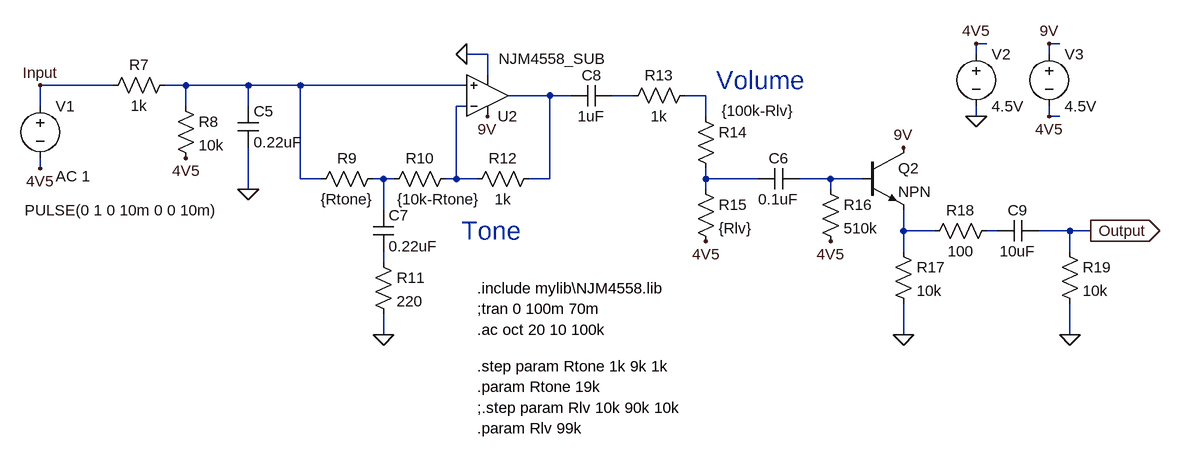
[diagram p0: schematic Tube_Screamer_Tone_10k.asc]
Tube_Screamer_Tone_10k.asc, the LTspice schematic file:
Version 4
SHEET 1 2708 1040
WIRE 1648 432 1632 432
WIRE 1760 432 1744 432
WIRE 880 448 848 448
WIRE 1632 448 1632 432
WIRE 1744 448 1744 432
WIRE 880 480 880 448
WIRE 304 496 192 496
WIRE 416 496 384 496
WIRE 512 496 416 496
WIRE 592 496 512 496
WIRE 848 496 592 496
WIRE 976 512 912 512
WIRE 1008 512 976 512
WIRE 1104 512 1072 512
WIRE 1216 512 1184 512
WIRE 192 528 192 496
WIRE 416 528 416 496
WIRE 512 528 512 496
WIRE 848 528 832 528
WIRE 1216 544 1216 512
WIRE 1632 544 1632 528
WIRE 1744 544 1744 528
WIRE 1760 544 1744 544
WIRE 192 624 192 608
WIRE 592 640 592 496
WIRE 624 640 592 640
WIRE 720 640 704 640
WIRE 736 640 720 640
WIRE 832 640 832 528
WIRE 832 640 816 640
WIRE 864 640 832 640
WIRE 976 640 976 512
WIRE 976 640 944 640
WIRE 1216 640 1216 624
WIRE 1296 640 1216 640
WIRE 1408 640 1360 640
WIRE 1456 640 1408 640
WIRE 512 656 512 592
WIRE 1216 656 1216 640
WIRE 1408 656 1408 640
WIRE 720 688 720 640
WIRE 1520 720 1520 688
WIRE 1568 720 1520 720
WIRE 1664 720 1648 720
WIRE 1776 720 1728 720
WIRE 1808 720 1776 720
WIRE 1520 752 1520 720
WIRE 1776 752 1776 720
WIRE 720 768 720 752
WIRE 720 880 720 848
WIRE 1520 880 1520 832
WIRE 1776 880 1776 832
FLAG 416 608 4V5
FLAG 512 656 0
FLAG 720 880 0
FLAG 1216 736 4V5
FLAG 1520 880 0
FLAG 1520 592 9V
FLAG 1408 736 4V5
FLAG 1776 880 0
FLAG 1808 720 Output
IOPIN 1808 720 Out
FLAG 192 496 Input
FLAG 880 544 9V
FLAG 848 448 0
FLAG 1632 544 0
FLAG 1632 432 4V5
FLAG 1744 544 4V5
FLAG 1744 432 9V
FLAG 192 624 4V5
SYMBOL voltage 192 512 R0
WINDOW 123 24 124 Left 2
WINDOW 39 0 0 Left 2
WINDOW 3 -24 176 Left 2
SYMATTR Value2 AC 1
SYMATTR InstName V1
SYMATTR Value PULSE(0 1 0 10m 0 0 10m)
SYMBOL res 400 480 R90
WINDOW 0 0 56 VBottom 2
WINDOW 3 32 56 VTop 2
SYMATTR InstName R7
SYMATTR Value 1k
SYMBOL res 400 512 R0
SYMATTR InstName R8
SYMATTR Value 10k
SYMBOL cap 496 528 R0
SYMATTR InstName C5
SYMATTR Value 0.22uF
SYMBOL Opamps\\opamp2 880 576 M180
WINDOW 3 17 121 Left 2
SYMATTR Value NJM4558_SUB
SYMATTR InstName U2
SYMBOL res 720 624 R90
WINDOW 0 0 56 VBottom 2
WINDOW 3 32 56 VTop 2
SYMATTR InstName R9
SYMATTR Value {Rtone}
SYMBOL res 832 624 R90
WINDOW 0 0 56 VBottom 2
WINDOW 3 32 27 VTop 2
SYMATTR InstName R10
SYMATTR Value {10k-Rtone}
SYMBOL cap 704 688 R0
SYMATTR InstName C7
SYMATTR Value 0.22uF
SYMBOL res 704 752 R0
SYMATTR InstName R11
SYMATTR Value 220
SYMBOL res 960 624 R90
WINDOW 0 0 56 VBottom 2
WINDOW 3 32 56 VTop 2
SYMATTR InstName R12
SYMATTR Value 1k
SYMBOL cap 1072 496 R90
WINDOW 0 0 32 VBottom 2
WINDOW 3 32 32 VTop 2
SYMATTR InstName C8
SYMATTR Value 1uF
SYMBOL res 1200 496 R90
WINDOW 0 0 56 VBottom 2
WINDOW 3 32 56 VTop 2
SYMATTR InstName R13
SYMATTR Value 1k
SYMBOL res 1200 528 R0
WINDOW 3 40 7 Left 2
SYMATTR InstName R14
SYMATTR Value {100k-Rlv}
SYMBOL res 1200 640 R0
SYMATTR InstName R15
SYMATTR Value {Rlv}
SYMBOL cap 1360 624 R90
WINDOW 0 0 32 VBottom 2
WINDOW 3 32 32 VTop 2
SYMATTR InstName C6
SYMATTR Value 0.1uF
SYMBOL res 1392 640 R0
SYMATTR InstName R16
SYMATTR Value 510k
SYMBOL npn 1456 592 R0
SYMATTR InstName Q2
SYMBOL res 1504 736 R0
SYMATTR InstName R17
SYMATTR Value 10k
SYMBOL res 1664 704 R90
WINDOW 0 0 56 VBottom 2
WINDOW 3 32 56 VTop 2
SYMATTR InstName R18
SYMATTR Value 100
SYMBOL cap 1728 704 R90
WINDOW 0 0 32 VBottom 2
WINDOW 3 32 32 VTop 2
SYMATTR InstName C9
SYMATTR Value 10uF
SYMBOL res 1760 736 R0
SYMATTR InstName R19
SYMATTR Value 10k
SYMBOL voltage 1632 432 R0
SYMATTR InstName V2
SYMATTR Value 4.5V
SYMBOL voltage 1744 432 R0
SYMATTR InstName V3
SYMATTR Value 4.5V
TEXT 840 720 Left 4 ;Tone
TEXT 1232 488 Left 4 ;Volume
TEXT 864 808 Left 2 !.include mylib\\NJM4558.lib
TEXT 864 840 Left 2 !;tran 0 100m 70m
TEXT 864 872 Left 2 !.ac oct 20 10 100k
TEXT 864 928 Left 2 !.step param Rtone 1k 9k 1k
TEXT 864 992 Left 2 !;.step param Rlv 10k 90k 10k
TEXT 864 960 Left 2 !.param Rtone 19k
TEXT 864 1024 Left 2 !.param Rlv 99k

The netlist it stands for:
* Tube_Screamer_Tone_10k.asc
V1 Input 4V5 PULSE(0 1 0 10m 0 0 10m) AC 1
R7 N001 Input 1k
R8 N001 4V5 10k
C5 N001 0 0.22uF
XU2 N001 N005 9V 0 N002 NJM4558_SUB  ; pins In+ In- V+ V- OUT
R9 N006 N001 {Rtone}
R10 N005 N006 {10k-Rtone}
C7 N006 N011 0.22uF
R11 N011 0 220
R12 N002 N005 1k
C8 N003 N002 1uF
R13 N004 N003 1k
R14 N004 N007 {100k-Rlv}
R15 N007 4V5 {Rlv}
C6 N008 N007 0.1uF
R16 N008 4V5 510k
Q2 9V N008 N009 0 NPN
R17 N009 0 10k
R18 N010 N009 100
C9 Output N010 10uF
R19 Output 0 10k
V2 4V5 0 4.5V
V3 9V 4V5 4.5V
.model NPN NPN
.model PNP PNP
.lib standard.bjt
* Tone
* Volume
.include mylib\NJM4558.lib
;tran 0 100m 70m
.ac oct 20 10 100k
.step param Rtone 1k 9k 1k
;.step param Rlv 10k 90k 10k
.param Rtone 19k
.param Rlv 99k
.backanno
.end